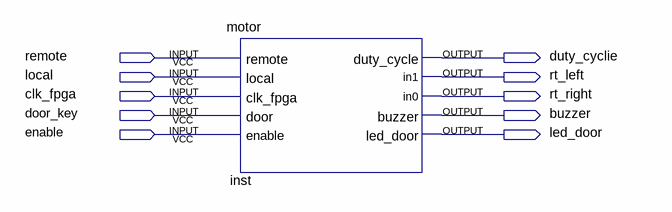
[diagram p0: schematic sheet]
// Quartus schematic motorv2.bdf as structural Verilog: 1 symbols, 10 pins
module motorv2 (
  input  remote,
  input  \local ,
  input  clk_fpga,
  input  door_key,
  input  enable,
  output duty_cyclie,
  output rt_left,
  output rt_right,
  output buzzer,
  output led_door
);

  motor inst (
    .remote(remote), .\local (\local ), .clk_fpga(clk_fpga), .door(door_key), .enable(enable),
    .duty_cycle(duty_cyclie), .in1(rt_left), .in0(rt_right), .buzzer(buzzer), .led_door(led_door));
endmodule
